# EAGLE design MassHackersBadge2015 (EAGLE 6.6.0)
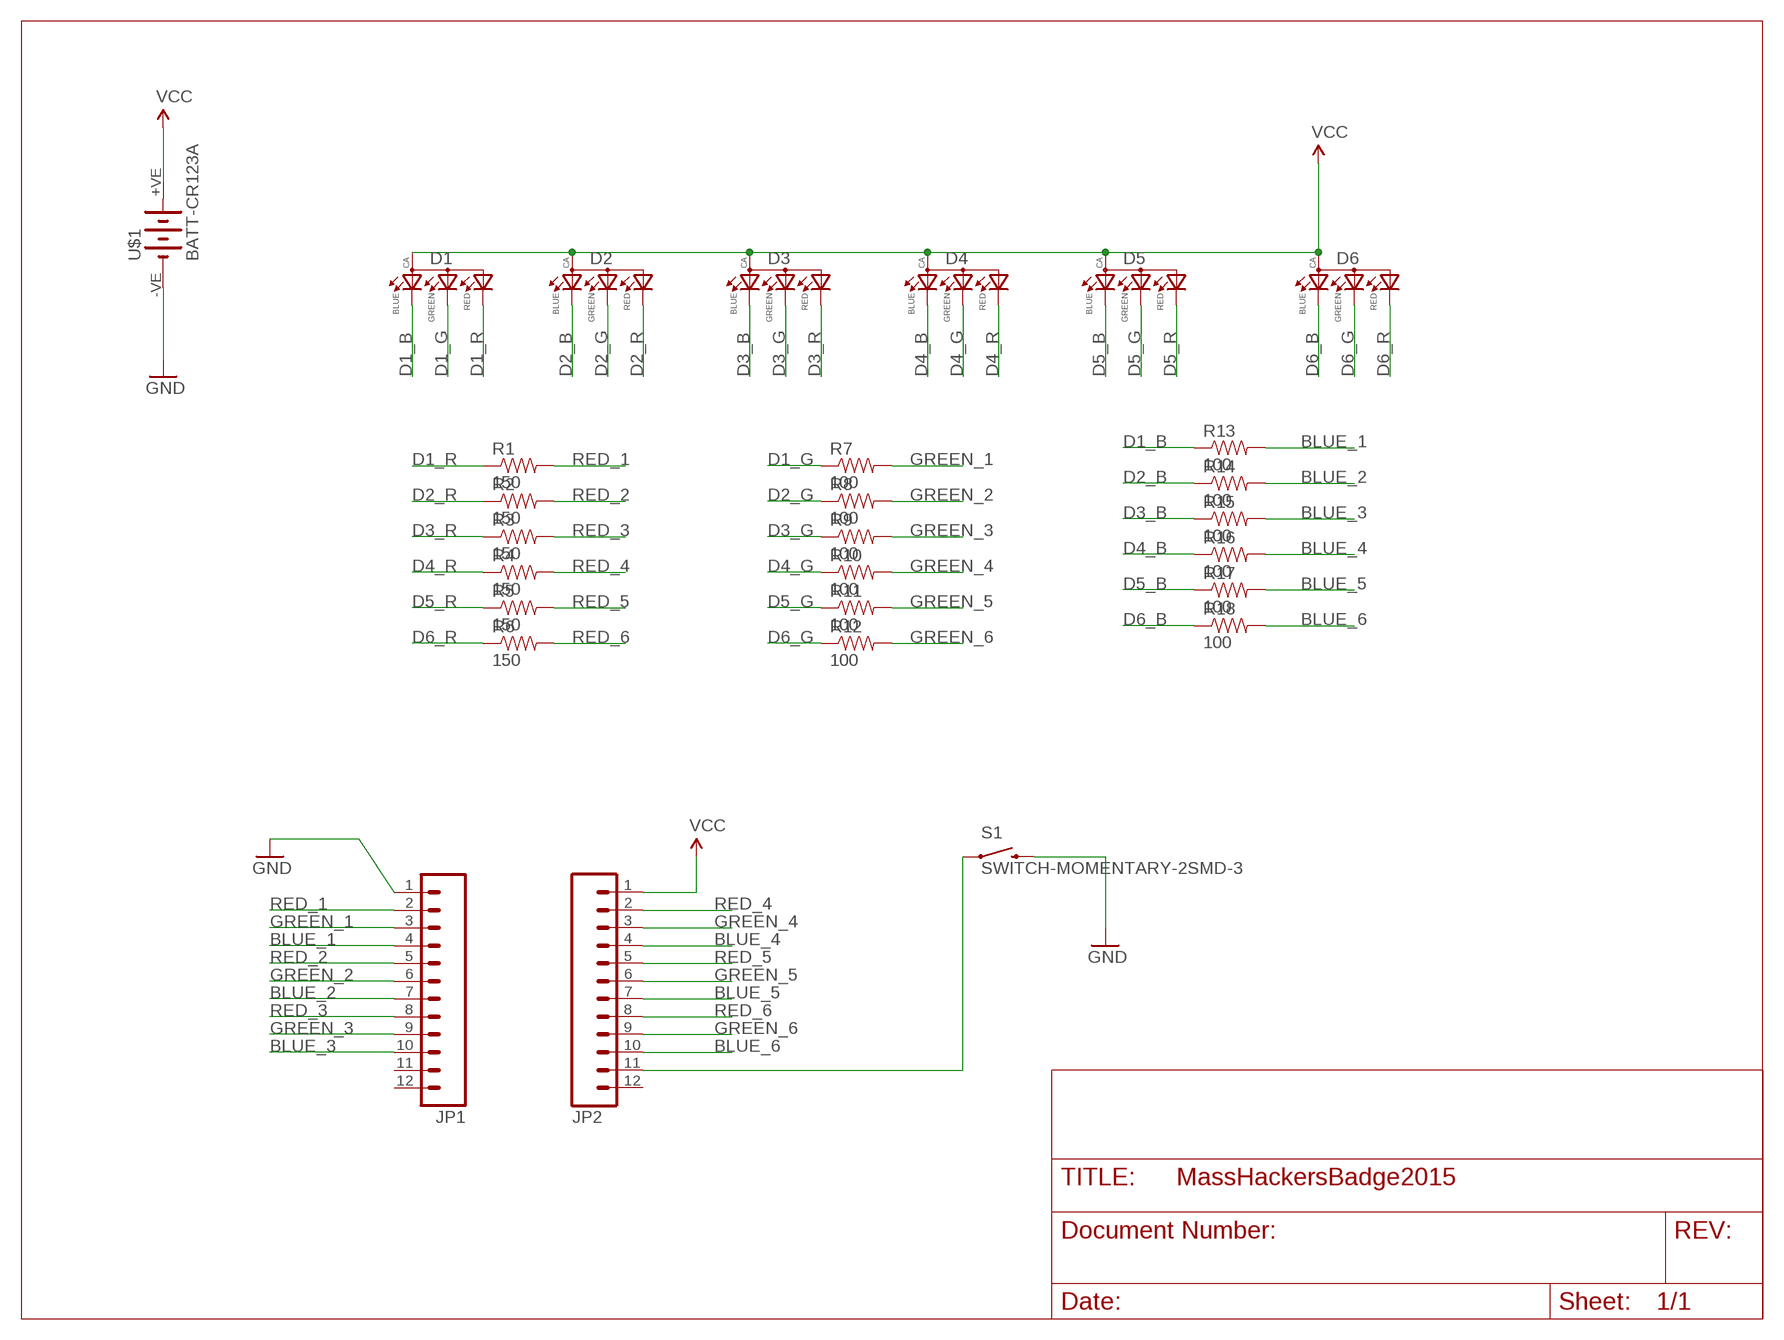
[diagram p0: schematic, sheet 1]

## Parts
D1  0.13_RGB_LEDPLCC  [P-LCC-4-3]
D2  0.13_RGB_LEDPLCC  [P-LCC-4-3]
D3  0.13_RGB_LEDPLCC  [P-LCC-4-3]
D4  0.13_RGB_LEDPLCC  [P-LCC-4-3]
D5  0.13_RGB_LEDPLCC  [P-LCC-4-3]
D6  0.13_RGB_LEDPLCC  [P-LCC-4-3]
JP1  M12PTH  [1X12]
JP2  M12PTH  [1X12]
R1  150  RESISTOR0603-RES  [0603-RES]
R2  150  RESISTOR0603-RES  [0603-RES]
R3  150  RESISTOR0603-RES  [0603-RES]
R4  150  RESISTOR0603-RES  [0603-RES]
R5  150  RESISTOR0603-RES  [0603-RES]
R6  150  RESISTOR0603-RES  [0603-RES]
R7  100  RESISTOR0603-RES  [0603-RES]
R8  100  RESISTOR0603-RES  [0603-RES]
R9  100  RESISTOR0603-RES  [0603-RES]
R10  100  RESISTOR0603-RES  [0603-RES]
R11  100  RESISTOR0603-RES  [0603-RES]
R12  100  RESISTOR0603-RES  [0603-RES]
R13  100  RESISTOR0603-RES  [0603-RES]
R14  100  RESISTOR0603-RES  [0603-RES]
R15  100  RESISTOR0603-RES  [0603-RES]
R16  100  RESISTOR0603-RES  [0603-RES]
R17  100  RESISTOR0603-RES  [0603-RES]
R18  100  RESISTOR0603-RES  [0603-RES]
S1  SWITCH-MOMENTARY-2SMD-3  [TACTILE_SWITCH_SMD-3]
U$1  BATT-CR123A  [KEYSTONE-2/3A]

## Nets
BLUE_1: JP1.4 R13.2
BLUE_2: JP1.7 R14.2
BLUE_3: JP1.10 R15.2
BLUE_4: JP2.4 R16.2
BLUE_5: JP2.7 R17.2
BLUE_6: JP2.10 R18.2
D1_B: D1.3(BLUE) R13.1
D1_G: D1.2(GREEN) R7.1
D1_R: D1.1(RED) R1.1
D2_B: D2.3(BLUE) R14.1
D2_G: D2.2(GREEN) R8.1
D2_R: D2.1(RED) R2.1
D3_B: D3.3(BLUE) R15.1
D3_G: D3.2(GREEN) R9.1
D3_R: D3.1(RED) R3.1
D4_B: D4.3(BLUE) R16.1
D4_G: D4.2(GREEN) R10.1
D4_R: D4.1(RED) R4.1
D5_B: D5.3(BLUE) R17.1
D5_G: D5.2(GREEN) R11.1
D5_R: D5.1(RED) R5.1
D6_B: D6.3(BLUE) R18.1
D6_G: D6.2(GREEN) R12.1
D6_R: D6.1(RED) R6.1
GND: JP1.1 S1.4 U$1.-VE(-)
GREEN_1: JP1.3 R7.2
GREEN_2: JP1.6 R8.2
GREEN_3: JP1.9 R9.2
GREEN_4: JP2.3 R10.2
GREEN_5: JP2.6 R11.2
GREEN_6: JP2.9 R12.2
N$19: JP2.11 S1.1
RED_1: JP1.2 R1.2
RED_2: JP1.5 R2.2
RED_3: JP1.8 R3.2
RED_4: JP2.2 R4.2
RED_5: JP2.5 R5.2
RED_6: JP2.8 R6.2
VCC: D1.4(ANODE) D2.4(ANODE) D3.4(ANODE) D4.4(ANODE) D5.4(ANODE) D6.4(ANODE) JP2.1 U$1.+VE(+)
Unconnected: JP1.11 JP1.12 JP2.12

## Library data of the parts
D1-D6 = SparkFun-LED:0.13_RGB_LED: Everlight Red/Green/Blue LED 67-23/R6GHBHC-B01/2T || 67-23/R6GHBH-B01 Size 3.2*2.8*1.9mm Mounting Type SMD Full-Color LED PLCC4 Emitting Color Red/Green/Blue (620-625/530-535/470-475 nm) Chip Material AlGaInP/InGaN/InGaN Luminous Intensity 57-112/225-450/36-72 mcd Viewing Angle 120 deg Lens Type-Color Water Clear Forward Voltage 2.0/3.5/3.5 V Forward Current 10 mA Maximum Forward Voltage 2.4/3.9/3.9 V Maximum Forward Current 25/25/25 mA Min-Max Operating Temperature -40C to +85C Factory Pack 2000 pcs-Reel RoHS ✓; PROD_ID: DIO-12986
JP1 JP2 = SparkFun-Connectors:M12: Header 12 Standard 12-pin 0.1" header. Use with straight break away headers (SKU : PRT-00116), right angle break away headers (PRT-00553), swiss pins (PRT-00743), machine pins (PRT-00117), and female headers (PRT-00115).
R1-R18 = SparkFun-Passives:RESISTOR: Resistor Basic schematic elements and footprints for 0603, 1206, and PTH resistors.
S1 = SparkFun-Electromechanical:SWITCH-MOMENTARY-2: Various NO switches- pushbuttons, reed, etc
U$1 = eagle-library-edeca.net-v5:BATT-CR123A: CR123A (2/3rd AA) battery holder Manufacturer: Keystone Mouser part: 534-1019

## Board
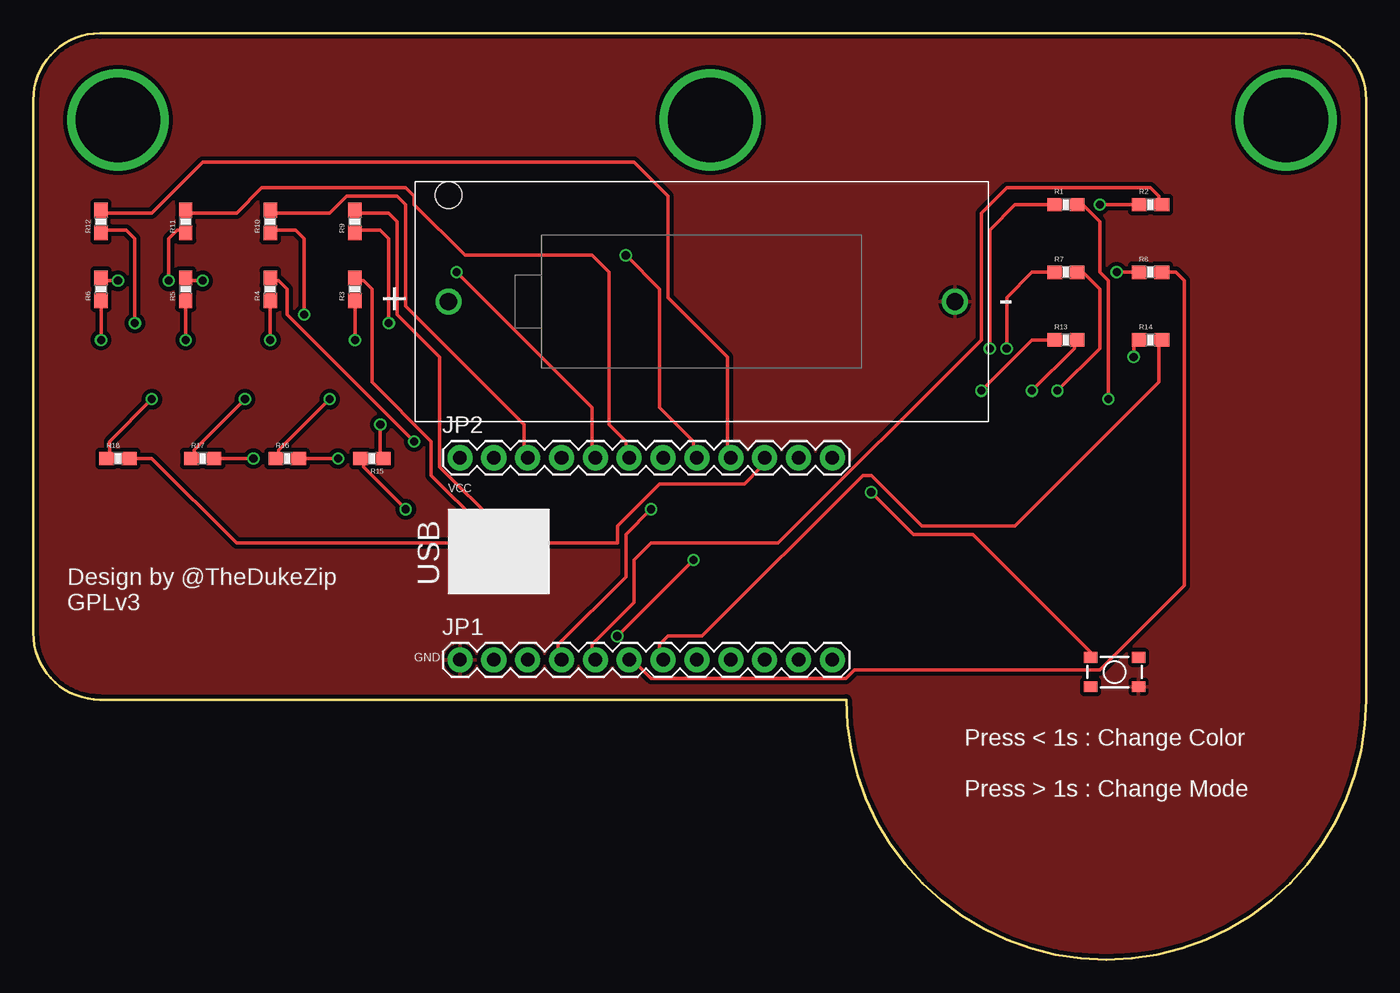
[diagram p1: board, top side]
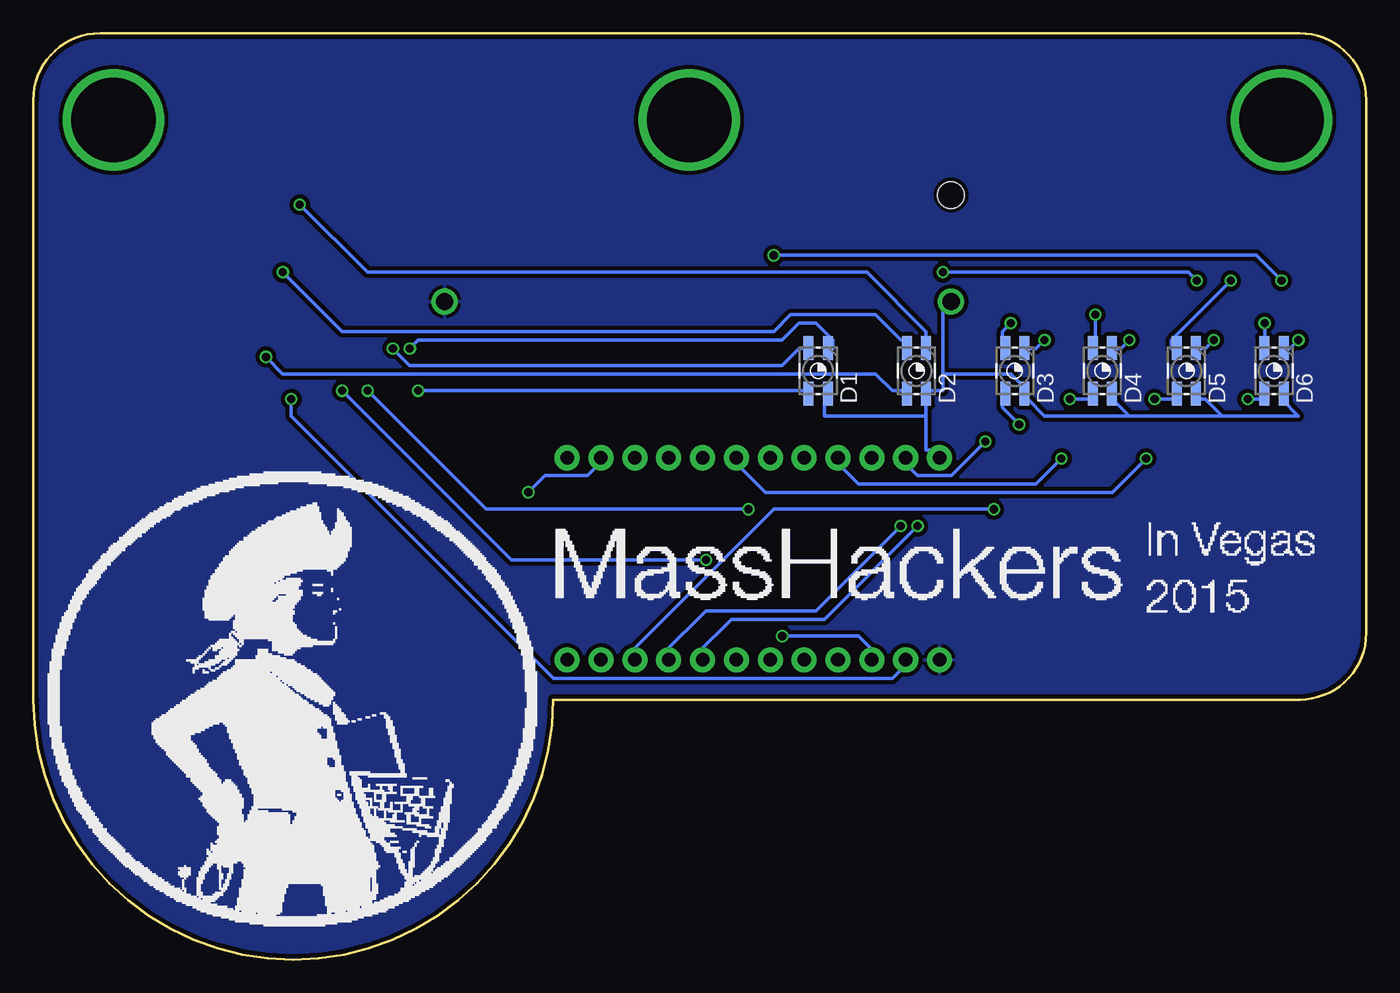
[diagram p2: board, bottom side, seen from below]

Size 100 x 69.5 mm. Coordinates in mm from the lower left corner, seen from the top.
Outline: 0,64.5 0,24.5 arc90 5,19.5 61,19.5 arc180 100,19.5 100,64.5 arc90 95,69.5 5,69.5 arc90 0,64.5
Copper layers (1*16): Top 0.035mm / dielectric 1.5mm / Bottom 0.035mm
Design rules "dirt_cheap_dirty_boards.v1": minimum track width 5mil, minimum drill 12mil, track to track 5mil, track to pad 5mil, pad to pad 5mil, via to via 5mil, smd to smd 0mil, copper to edge 10mil, drill to drill 10mil, minimum pad ring 10mil, minimum via ring 6mil, stop-mask expansion 2mil, vias tented up to drill 25mil, thermal gap 10mil

### Footprints (pad centres in the part's own frame; a part is rotated, then mirrored left to right if it is on the bottom)
P-LCC-4-3 = smd 0.75 x 1.8: 1 0.725,1.7; 2 -0.725,1.7; 3 -0.725,-1.7; 4 0.725,-1.7
1X12 = drill 1.016 pad 1.88: 1 0,0; 2 2.54,0; 3 5.08,0; 4 7.62,0; 5 10.16,0; 6 12.7,0; 7 15.24,0; 8 17.78,0; 9 20.32,0; 10 22.86,0; 11 25.4,0; 12 27.94,0
0603-RES = smd 1.1 x 1: 1 -0.85,0; 2 0.85,0
TACTILE_SWITCH_SMD-3 = smd 1 x 0.8: 1 -1.8,1.1; 2 1.8,1.1; 3 -1.8,-1.1; 4 1.8,-1.1
KEYSTONE-2/3A = drill 1.3: +VE 0,19; -VE 0,-19 | hole 2: 8,19

### Placement (x,y rotation side)
D1  41.12,44.17 0 bottom
D2  33.74,44.17 0 bottom
D3  26.36,44.17 0 bottom
D4  19.79,44.17 0 bottom
D5  13.49,44.17 0 bottom
D6  6.92,44.17 0 bottom
JP1  32.01,22.49 0 top
JP2  32.01,37.65 0 top
R1  77.47,56.65 0 top
R2  83.82,56.65 0 top
R3  24.13,50.3 90 top
R4  17.78,50.3 90 top
R5  11.43,50.3 90 top
R6  5.08,50.3 90 top
R7  77.47,51.57 0 top
R8  83.82,51.57 0 top
R9  24.13,55.38 90 top
R10  17.78,55.38 90 top
R11  11.43,55.38 90 top
R12  5.08,55.38 90 top
R13  77.47,46.49 0 top
R14  83.82,46.49 0 top
R15  25.4,37.6 180 top
R16  19.05,37.6 0 top
R17  12.7,37.6 0 top
R18  6.35,37.6 0 top
S1  81.12,21.57 0 top
U$1  50.14,49.37 90 top

### Tracks (layer width: path | path; a pad name or v marks a point on that pad's centre or on a via)
BLUE_1  (via drill 0.61)
  Top 0.254: v74.93,42.68 78.11,45.85 78.11,46.49 R13.2 | v46.35,33.79 44.45,31.88 44.45,28.71 39.37,23.63 39.37,23 JP1.4
  Bottom 0.254: v46.35,33.79 66.04,33.79 v74.93,42.68
BLUE_2
  Top 0.254: R14.2 84.45,46.49 84.45,43.31 73.66,32.52 66.67,32.52 62.87,36.33 62.23,36.33 50.16,24.27 47.62,24.27 46.99,23.63 46.99,23 JP1.7
BLUE_3  (via drill 0.61)
  Top 0.254: v27.94,33.79 24.77,36.97 24.77,37.6 R15.2
  Bottom 0.254: v27.94,33.79 44.45,33.79 55.24,23 JP1.10
BLUE_4  (via drill 0.61)
  Top 0.254: v22.86,37.6 R16.2
  Bottom 0.254: v22.86,37.6 24.77,35.7 38.1,35.7 40.01,37.6 JP2.4
BLUE_5  (via drill 0.61)
  Top 0.254: v16.51,37.6 R17.2
  Bottom 0.254: v16.51,37.6 19.05,35.06 45.09,35.06 47.62,37.6 JP2.7
BLUE_6
  Top 0.254: R18.2 8.89,37.6 15.24,31.25 43.81,31.25 43.81,32.52 46.99,35.7 53.34,35.7 54.61,36.97 54.61,37.6 JP2.10
D1_B  (via drill 0.61)
  Top 0.254: R13.1 74.93,46.49 v71.12,42.68
  Bottom 0.254: v71.12,42.68 41.91,42.68 D1.3
D1_G  (via drill 0.61)
  Top 0.254: R7.1 74.93,51.57 73.03,49.66 v73.03,45.85
  Bottom 0.254: v73.03,45.85 71.75,44.59 43.81,44.59 42.55,45.85 41.91,45.85 D1.2
D1_R  (via drill 0.61)
  Top 0.254: R1.1 73.66,56.65 71.75,54.74 v71.75,45.85
  Bottom 0.254: v71.75,45.85 71.12,46.49 43.81,46.49 42.55,47.76 41.27,47.76 40.01,46.49 40.01,45.85 40.64,45.85 D1.1
D2_B  (via drill 0.61)
  Top 0.254: v82.55,45.22 82.55,46.49 R14.1
  Bottom 0.254: v82.55,45.22 81.28,43.95 36.83,43.95 35.56,42.68 34.29,42.68 D2.3
D2_G  (via drill 0.61)
  Top 0.254: v81.28,51.57 R8.1
  Bottom 0.254: v81.28,51.57 76.83,47.12 44.45,47.12 43.18,48.4 36.83,48.4 34.92,46.49 34.29,46.49 D2.2
D2_R  (via drill 0.61)
  Top 0.254: v80.01,56.65 R2.1
  Bottom 0.254: v80.01,56.65 74.93,51.57 37.47,51.57 33.02,47.12 33.02,46.49 D2.1
D3_B  (via drill 0.61)
  Top 0.254: v26.04,40.14 26.04,37.6 R15.1
  Bottom 0.254: v26.04,40.14 27.3,41.41 27.3,42.05 D3.3
D3_G  (via drill 0.61)
  Top 0.254: v26.67,47.76 26.67,54.11 26.04,54.74 24.13,54.74 R9.1
  Bottom 0.254: v26.67,47.76 27.3,47.12 27.3,46.49 D3.2
D3_R  (via drill 0.61)
  Top 0.254: v24.13,46.49 R3.1
  Bottom 0.254: v24.13,46.49 24.77,45.85 25.4,45.85 D3.1
D4_B  (via drill 0.61)
  Top 0.254: v22.23,42.05 18.41,38.23 18.41,37.6 R16.1
  Bottom 0.254: v22.23,42.05 20.32,42.05 D4.3
D4_G  (via drill 0.61)
  Top 0.254: v20.32,48.4 20.32,54.11 19.68,54.74 17.78,54.74 R10.1
  Bottom 0.254: v20.32,48.4 20.32,46.49 D4.2
D4_R  (via drill 0.61)
  Top 0.254: v17.78,46.49 R4.1
  Bottom 0.254: v17.78,46.49 18.41,45.85 19.05,45.85 D4.1
D5_B  (via drill 0.61)
  Top 0.254: v15.88,42.05 12.06,38.23 12.06,37.6 R17.1
  Bottom 0.254: v15.88,42.05 13.97,42.05 D5.3
D5_G  (via drill 0.61)
  Top 0.254: v10.16,50.94 10.16,54.11 10.79,54.74 11.43,54.74 R11.1
  Bottom 0.254: v10.16,50.94 14.61,46.49 14.61,45.85 13.97,45.85 D5.2
D5_R  (via drill 0.61)
  Top 0.254: v11.43,46.49 R5.1
  Bottom 0.254: v11.43,46.49 12.06,45.85 12.7,45.85 D5.1
D6_B  (via drill 0.61)
  Top 0.254: v8.89,42.05 5.71,38.87 5.71,37.6 R18.1
  Bottom 0.254: v8.89,42.05 7.62,42.05 D6.3
D6_G  (via drill 0.61)
  Top 0.254: v7.62,47.76 7.62,54.11 6.99,54.74 5.08,54.74 R12.1
  Bottom 0.254: v7.62,47.76 7.62,46.49 D6.2
D6_R  (via drill 0.61)
  Top 0.254: v5.08,46.49 R6.1
  Bottom 0.254: v5.08,46.49 5.71,45.85 6.35,45.85 D6.1
GND
  pour Top (isolate 0.305): 0,64.5 0,24.5 arc90 5,19.5 61,19.5 arc90 80,0.5 81,0.5 arc90 100,19.5 100,64.5 arc90 95,69.5 5,69.5 arc90
  pour Bottom (isolate 0.305): 0,64.5 0,24.5 arc90 5,19.5 61,19.5 arc90 80,0.5 81,0.5 arc90 100,19.5 100,64.5 arc90 95,69.5 5,69.5 arc90
GREEN_1  (via drill 0.61)
  Top 0.254: v76.83,42.68 80.01,45.85 80.01,50.3 78.74,51.57 R7.2 | v43.81,24.27 v49.53,29.98
  Bottom 0.254: v76.83,42.68 64.14,29.98 v49.53,29.98 | v43.81,24.27 38.1,24.27 36.83,23 JP1.3
GREEN_2
  Top 0.254: R8.2 85.72,51.57 86.36,50.94 86.36,28.07 80.01,21.73 61.59,21.73 60.96,21.09 46.35,21.09 45.09,22.36 JP1.6
GREEN_3  (via drill 0.61)
  Top 0.254: v34.92,32.52 30.48,36.97 30.48,45.22 27.3,48.4 27.3,55.38 26.67,56.02 24.13,56.02 R9.2
  Bottom 0.254: v34.92,32.52 41.27,26.17 49.53,26.17 52.7,23 JP1.9
GREEN_4
  Top 0.254: R10.2 17.78,56.02 22.23,56.02 23.5,57.28 27.3,57.28 27.94,56.65 27.94,49.03 36.83,40.14 36.83,38.23 JP2.3
GREEN_5
  Top 0.254: R11.2 11.43,56.02 15.24,56.02 17.14,57.92 27.94,57.92 28.57,57.28 28.57,56.65 32.38,52.84 41.91,52.84 43.18,51.57 43.18,40.14 44.45,38.87 44.45,38.23 JP2.6
GREEN_6
  Top 0.254: R12.2 5.08,56.02 8.89,56.02 12.7,59.83 45.09,59.83 47.62,57.28 47.62,49.66 52.07,45.22 52.07,38.23 JP2.9
N$1  (via drill 6.35 pad 7.62)
  other vias: 6.35,63
N$2  (via drill 6.35 pad 7.62)
  other vias: 93.98,63
N$3  (via drill 6.35 pad 7.62)
  other vias: 50.8,63
N$19  (via drill 0.61)
  Top 0.254: v62.87,35.06 66.04,31.88 70.48,31.88 79.38,23 S1.1
  Bottom 0.254: v62.87,35.06 61.59,36.33 58.42,36.33 57.15,37.6 JP2.11
RED_1  (via drill 0.61)
  Top 0.254: v80.64,42.05 80.64,50.94 80.01,51.57 80.01,55.38 78.74,56.65 R1.2
  Bottom 0.254: v80.64,42.05 80.64,40.77 78.74,38.87 60.96,21.09 35.56,21.09 34.29,22.36 JP1.2
RED_2
  Top 0.254: R2.2 84.45,56.65 84.45,57.28 83.82,57.92 73.03,57.92 71.12,56.02 71.12,46.49 55.88,31.25 46.35,31.25 45.09,29.98 45.09,26.8 41.91,23.63 41.91,23 JP1.5
RED_3  (via drill 0.61)
  Top 0.254: v33.66,32.52 29.84,36.33 29.84,38.87 25.4,43.31 25.4,49.66 25.4,50.3 24.77,50.94 24.13,50.94 R3.2
  Bottom 0.254: v33.66,32.52 40.64,25.54 47.62,25.54 50.16,23 JP1.8
RED_4  (via drill 0.61)
  Top 0.254: v28.57,38.87 19.05,48.4 19.05,50.3 18.41,50.94 17.78,50.94 R4.2
  Bottom 0.254: v28.57,38.87 31.11,36.33 33.66,36.33 34.92,37.6 JP2.2
RED_5  (via drill 0.61)
  Top 0.254: v12.7,50.94 11.43,50.94 R5.2 | v31.75,51.57 41.91,41.41 41.91,38.23 JP2.5
  Bottom 0.254: v12.7,50.94 13.34,51.57 v31.75,51.57
RED_6  (via drill 0.61)
  Top 0.254: v6.35,50.94 5.08,50.94 R6.2 | v44.45,52.84 46.99,50.3 46.99,41.41 49.53,38.87 49.53,38.23 JP2.8
  Bottom 0.254: v6.35,50.94 8.26,52.84 v44.45,52.84
VCC
  Bottom 0.254: 10.79,40.77 5.08,40.77 6.35,42.05 D6.4 | 10.79,40.77 12.06,42.05 12.7,42.05 D5.4 | 17.78,40.77 19.05,42.05 D4.4 | 10.79,40.77 17.78,40.77 | 17.78,40.77 24.13,40.77 25.4,42.05 D3.4 25.4,42.68 26.67,43.95 31.75,43.95 | 33.02,40.77 33.02,38.23 32.38,38.23 JP2.1 | 33.02,40.77 33.02,42.05 D2.4 33.02,42.68 31.75,42.68 31.75,43.95 | 33.02,40.77 40.64,40.77 40.64,42.05 D1.4 | 31.75,43.95 31.75,49.03 U$1.+VE

### Text on the board
tPlace: + | - | VCC | USB | Design by @TheDukeZip / GPLv3 | GND | Press < 1s : Change Color / / Press > 1s : Change Mode